# EAGLE schematic MCU Standard (EAGLE 9.6.2)
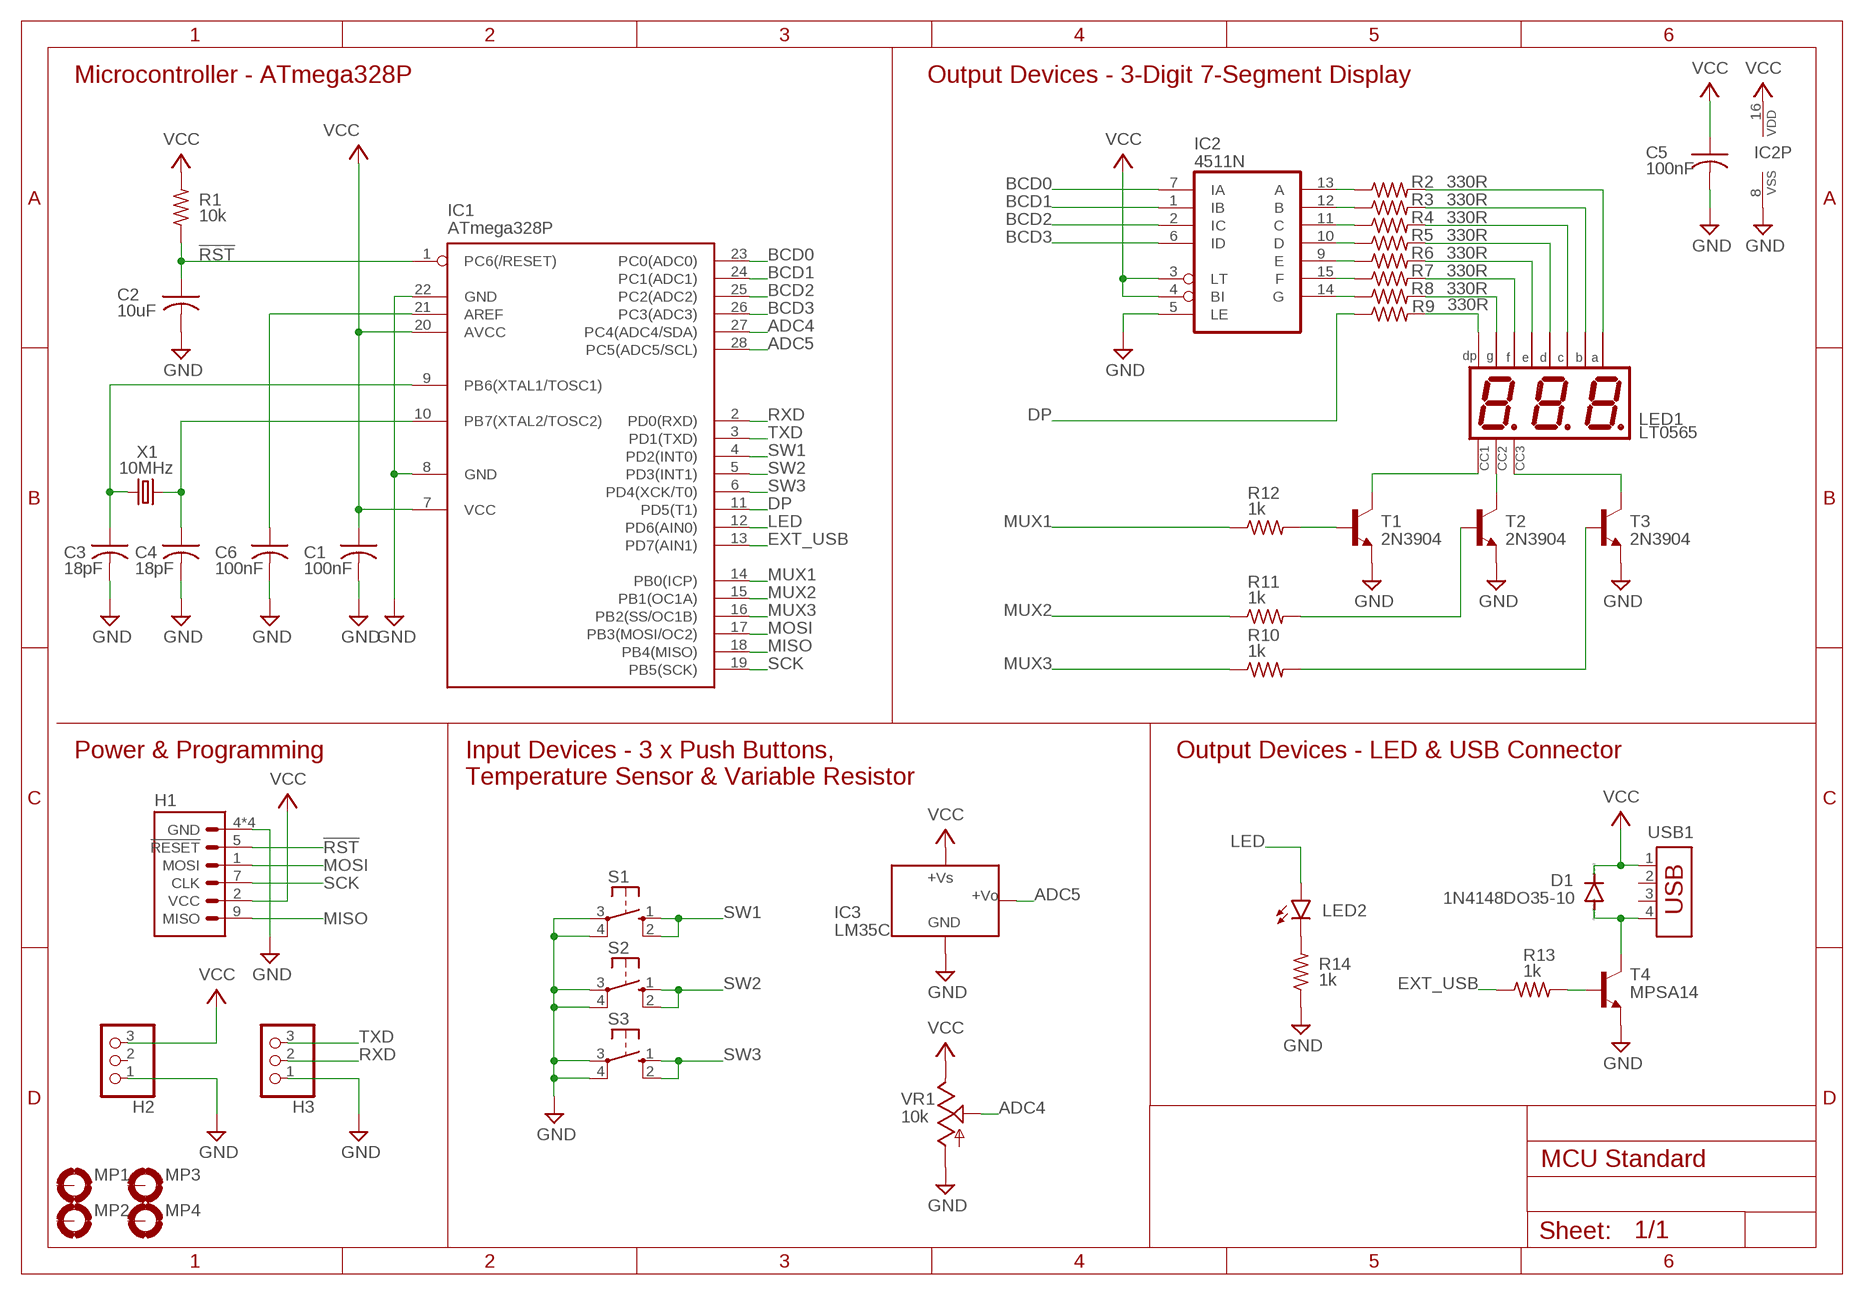
[diagram p0: schematic, sheet 1]

## Parts
C1  100nF  C-US050-024X044  [C050-024X044]
C2  10uF  C-US050-024X044  [C050-024X044]
C3  18pF  C-US050-024X044  [C050-024X044]
C4  18pF  C-US050-024X044  [C050-024X044]
C5  100nF  C-US050-024X044  [C050-024X044]
C6  100nF  C-US050-024X044  [C050-024X044]
D1  1N4148DO35-10  [DO35-10]
H1  MISO_MOSI_IPC-10V  [IDC-10V]
H2  PINHD-1X03_2.54-90°  [1X03/90]
H3  PINHD-1X03_2.54-90°  [1X03/90]
IC1  ATmega328P  MEGA8-P  [DIL28-3]
IC2  4511N  [DIL16]
IC3  LM35C  [TO92]
LED1  LT0565  [BX56/BX55]
LED2  LED3MM  [LED3MM]
MP1  MOUNT-PAD-ROUND3.2  [3,2-PAD]
MP2  MOUNT-PAD-ROUND3.2  [3,2-PAD]
MP3  MOUNT-PAD-ROUND3.2  [3,2-PAD]
MP4  MOUNT-PAD-ROUND3.2  [3,2-PAD]
R1  10k  R-US_0207/10  [0207/10]
R2  330R  R-US_0207/10  [0207/10]
R3  330R  R-US_0207/10  [0207/10]
R4  330R  R-US_0207/10  [0207/10]
R5  330R  R-US_0207/10  [0207/10]
R6  330R  R-US_0207/10  [0207/10]
R7  330R  R-US_0207/10  [0207/10]
R8  330R  R-US_0207/10  [0207/10]
R9  330R  R-US_0207/10  [0207/10]
R10  1k  R-US_0207/10  [0207/10]
R11  1k  R-US_0207/10  [0207/10]
R12  1k  R-US_0207/10  [0207/10]
R13  1k  R-US_0207/10  [0207/10]
R14  1k  R-US_0207/10  [0207/10]
S1  10-XX  [B3F-10XX]
S2  10-XX  [B3F-10XX]
S3  10-XX  [B3F-10XX]
T1  2N3904  [TO92]
T2  2N3904  [TO92]
T3  2N3904  [TO92]
T4  MPSA14  [TO92]
USB1  USB-787616  [USB]
VR1  10k  POTENTIOMETER_PT10  [PT-10]
X1  10MHz  CRYSTAL_HC49/S  [HC49/S]

## Nets
!RST [Signal]: C2.1 H1.5(!RESET) IC1.1(PC6(/RESET)) R1.1
ADC4 [Signal]: IC1.27(PC4(ADC4/SDA)) VR1.3(S)
ADC5 [Signal]: IC1.28(PC5(ADC5/SCL)) IC3.2(VO)
BCD0 [Signal]: IC1.23(PC0(ADC0)) IC2.7(IA)
BCD1 [Signal]: IC1.24(PC1(ADC1)) IC2.1(IB)
BCD2 [Signal]: IC1.25(PC2(ADC2)) IC2.2(IC)
BCD3 [Signal]: IC1.26(PC3(ADC3)) IC2.6(ID)
DP [Signal]: IC1.11(PD5(T1)) R9.1
EXT_USB [Signal]: IC1.13(PD7(AIN1)) R13.1
GND [Power]: C1.2 C2.2 C3.2 C4.2 C5.2 C6.2 H1.4(GND) H1.6(GND) H1.8(GND) H1.10(GND) H2.1 H3.1 IC1.8(GND) IC1.22(GND) IC2.5(LE) IC2.8(VSS) IC3.1(GND) R14.1 S1.3(P) S1.4(P1) S2.3(P) S2.4(P1) S3.3(P) S3.4(P1) T1.3(E) T2.3(E) T3.3(E) T4.3(E) VR1.1(A)
LED [Signal]: IC1.12(PD6(AIN0)) LED2.A
MISO [Signal]: H1.9(MISO) IC1.18(PB4(MISO))
MOSI [Signal]: H1.1(MOSI) IC1.17(PB3(MOSI/OC2))
MUX1 [Signal]: IC1.14(PB0(ICP)) R12.1
MUX2 [Signal]: IC1.15(PB1(OC1A)) R11.1
MUX3 [Signal]: IC1.16(PB2(SS/OC1B)) R10.1
N$1 [Signal]: C3.1 IC1.9(PB6(XTAL1/TOSC1)) X1.1
N$2 [Signal]: C4.1 IC1.10(PB7(XTAL2/TOSC2)) X1.2
N$3 [Signal]: LED1.5(G) R8.2
N$4 [Signal]: LED1.10(F) R7.2
N$5 [Signal]: LED1.1(E) R6.2
N$6 [Signal]: LED1.2(D) R5.2
N$7 [Signal]: LED1.4(C) R4.2
N$8 [Signal]: LED1.7(B) R3.2
N$9 [Signal]: LED1.11(A) R2.2
N$10 [Signal]: IC2.13(A) R2.1
N$11 [Signal]: IC2.12(B) R3.1
N$12 [Signal]: IC2.11(C) R4.1
N$13 [Signal]: IC2.10(D) R5.1
N$14 [Signal]: IC2.9(E) R6.1
N$15 [Signal]: IC2.15(F) R7.1
N$16 [Signal]: IC2.14(G) R8.1
N$17 [Signal]: LED1.3(DP) R9.2
N$18: C6.1 IC1.21(AREF)
N$19 [Signal]: LED1.8(CA) T3.1(C)
N$24 [Signal]: LED1.9(CA) T2.1(C)
N$25 [Signal]: LED1.12(CA) T1.1(C)
N$26 [Signal]: R10.2 T3.2(B)
N$27 [Signal]: R11.2 T2.2(B)
N$28 [Signal]: R12.2 T1.2(B)
N$33 [Signal]: R13.2 T4.2(B)
N$35 [Signal]: D1.A T4.1(C) USB1.4
N$37 [Signal]: LED2.K(C) R14.2
RXD: H3.2 IC1.2(PD0(RXD))
SCK [Signal]: H1.7(CLK) IC1.19(PB5(SCK))
SW1 [Signal]: IC1.4(PD2(INT0)) S1.1(S) S1.2(S1)
SW2 [Signal]: IC1.5(PD3(INT1)) S2.1(S) S2.2(S1)
SW3 [Signal]: IC1.6(PD4(XCK/T0)) S3.1(S) S3.2(S1)
TXD: H3.3 IC1.3(PD1(TXD))
VCC [Power]: C1.1 C5.1 D1.C H1.2(VCC) H2.3 IC1.7(VCC) IC1.20(AVCC) IC2.3(LT) IC2.4(BI) IC2.16(VDD) IC3.3(+VS) R1.2 USB1.1 VR1.2(E)
Unconnected: H2.2 MP1.B3,2(MOUNT) MP2.B3,2(MOUNT) MP3.B3,2(MOUNT) MP4.B3,2(MOUNT) USB1.2 USB1.3

## Notes on the sheet
- Microcontroller - ATmega328P | Output Devices - 3-Digit 7-Segment Display
- Power & Programming | Output Devices - LED & USB Connector
- Input Devices - 3 x Push Buttons,
  Temperature Sensor & Variable Resistor

## Library data of the parts
C1-C6 = MCU Project:C-US
D1 = MCU Project:1N4148: DIODE high speed (Philips)
H1 = MCU Project:MISO_MOSI
H2 H3 = MCU Project:PINHD-1X03
IC1 = MCU Project:MEGA8-P: MICROCONTROLLER 8 Kbytes FLASH, 1 kbytes SRAM, 512 bytes EEPROM, USART, 4-channel 10 bit ADC, 2-channel 8 bit ADC Pin compatible with Atmega48, ATMega88, ATMega168 Source: avr.lbr; OC_FARNELL: unknown; OC_NEWARK: unknown
IC2 = MCU Project:4511: BCD to 7-segment LATCH/DECODER/DRIVER
IC3 = MCU Project:LM35C
LED1 = MCU Project:LT0565: 3-Digit Common Cathode LED Numeric Display
LED2 = MCU Project:LED3MM
MP1-MP4 = holes:MOUNT-PAD-ROUND: MOUNTING PAD, round
R1-R14 = MCU Project:R-US
S1-S3 = MCU Project:10-XX: OMRON SWITCH; MPN: B3F-1000; OC_FARNELL: 176432; OC_NEWARK: 36M3542
T1-T3 = MCU Project:2N3904: NPN TRANSISTOR
T4 = MCU Project:MPSA14
USB1 = MCU Project:USB-787616: AMP connector
VR1 = MCU Project:POTENTIOMETER
X1 = MCU Project:CRYSTAL

## Net classes
1 Power: width 0.635 mm
2 Signal: width 0.406 mm